# Altium project Systems Level Tester.PrjPcb
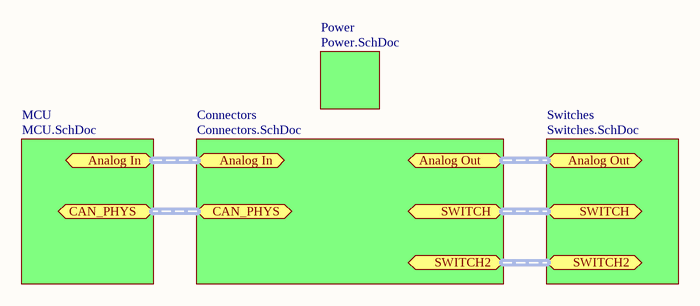
[diagram p0: Main.SchDoc]
5 sheets, 38 parts. Net scope: flat (ports and power ports of the same name join across sheets).
Board file: Systems Level Tester.PcbDoc
Sheets:
  Main.SchDoc
    Switches = Switches.SchDoc
    MCU = MCU.SchDoc
    Connectors = Connectors.SchDoc
    Power = Power.SchDoc

## Sheet Main.SchDoc
size Letter

### Sub-sheets
Connectors = Connectors.SchDoc: no entries
MCU = MCU.SchDoc: no entries
Power = Power.SchDoc: no entries
Switches = Switches.SchDoc: no entries

### Ports
Analog In (harness Analog_In), Analog Out (harness Analog_Out), CAN_PHYS (harness CAN_PHYS), SWITCH2 (harness SWITCH2), SWITCH (harness SWITCH)

## Sheet Switches.SchDoc
size Letter
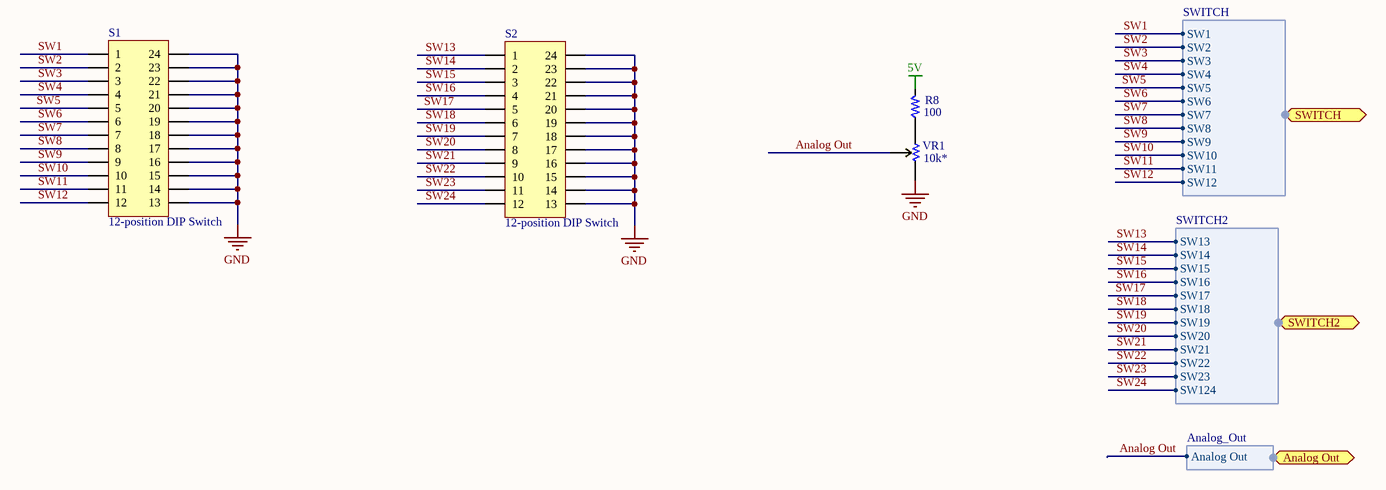
[diagram p1: Switches.SchDoc]

### Parts
R8  Resistance: 100  [PCB_GENERIC_SMD_0603]  (hidden comment: SCH_GENERIC_RESISTOR_0603)
S1  12-position DIP Switch  [12-Position DIP Switch]
S2  12-position DIP Switch  [12-Position DIP Switch]
VR1  10k*  [Rotary Pot]

### Ports
Analog Out (harness Analog_Out), SWITCH2 (harness SWITCH2), SWITCH (harness SWITCH)

### Harnesses
SWITCH: SW1, SW2, SW3, SW4, SW5, SW6, SW7, SW8, SW9, SW10, SW11, SW12
Analog_Out: Analog Out
SWITCH2: SW13, SW14, SW15, SW16, SW17, SW18, SW19, SW20, SW21, SW22, SW23, SW124

### Nets
5V: R8.2
GND: S1.13 S1.14 S1.15 S1.16 S1.17 S1.18 S1.19 S1.20 S1.21 S1.22 S1.23 S1.24 S2.13 S2.14 S2.15 S2.16 S2.17 S2.18 S2.19 S2.20 S2.21 S2.22 S2.23 S2.24 VR1.3
Analog Out: VR1.2 ; port Analog Out.Analog Out
SW1: S1.1 ; port SWITCH.SW1
SW2: S1.2 ; port SWITCH.SW2
SW3: S1.3 ; port SWITCH.SW3
SW4: S1.4 ; port SWITCH.SW4
SW5: S1.5 ; port SWITCH.SW5
SW6: S1.6 ; port SWITCH.SW6
SW7: S1.7 ; port SWITCH.SW7
SW8: S1.8 ; port SWITCH.SW8
SW9: S1.9 ; port SWITCH.SW9
SW10: S1.10 ; port SWITCH.SW10
SW11: S1.11 ; port SWITCH.SW11
SW12: S1.12 ; port SWITCH.SW12
SW13: S2.1 ; port SWITCH2.SW13
SW14: S2.2 ; port SWITCH2.SW14
SW15: S2.3 ; port SWITCH2.SW15
SW16: S2.4 ; port SWITCH2.SW16
SW17: S2.5 ; port SWITCH2.SW17
SW18: S2.6 ; port SWITCH2.SW18
SW19: S2.7 ; port SWITCH2.SW19
SW20: S2.8 ; port SWITCH2.SW20
SW21: S2.9 ; port SWITCH2.SW21
SW22: S2.10 ; port SWITCH2.SW22
SW23: S2.11 ; port SWITCH2.SW23
SW24: S2.12 ; port SWITCH2.SW124
NetR8_1: R8.1 VR1.1

### Library data of the parts
R8 = SCH_GENERIC_RESISTOR_0603: Generic SMD resistor 0603
S1 S2 = 12-position DIP Switch: Manufacturer: CTS Electronics; Manufacturer No.: 209-12LPST
VR1 = Rotary Pot: Manufacturer: CTS Electronics; Manufacturer ID: 296UD103B1N; Max Resistance: 10k; Tolerance: 20%

## Sheet MCU.SchDoc
size Letter
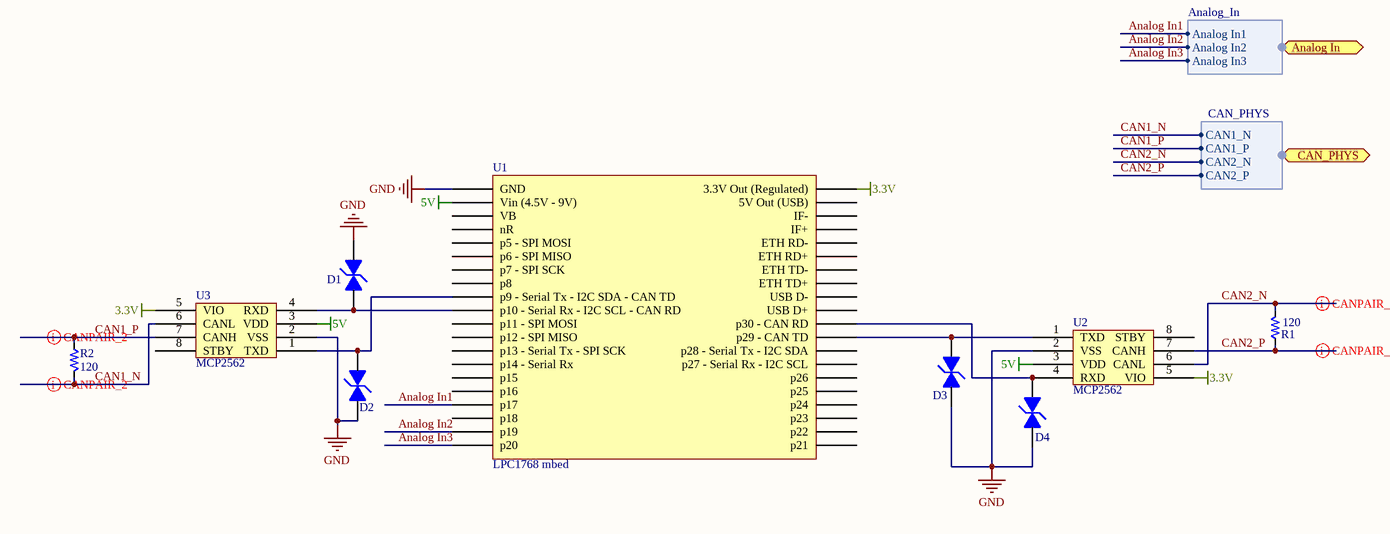
[diagram p2: MCU.SchDoc]

### Parts
D1  TVS Diode  [TVS Diode]  (value not drawn)
D2  TVS Diode  [TVS Diode]  (value not drawn)
D3  TVS Diode  [TVS Diode]  (value not drawn)
D4  TVS Diode  [TVS Diode]  (value not drawn)
R1  120  [PCB_GENERIC_SMD_0603]
R2  120  [PCB_GENERIC_SMD_0603]
U1  LPC1768 mbed  [LPC 1768 mbed Layout]
U2  MCP2562  [MCP2562]
U3  MCP2562  [MCP2562]

### Ports
Analog In (harness Analog_In), CAN_PHYS (harness CAN_PHYS)

### Harnesses
Analog_In: Analog In1, Analog In2, Analog In3
CAN_PHYS: CAN1_N, CAN1_P, CAN2_N, CAN2_P

### Nets
3.3V: U1.40(3.3V_Out_(Regulated)) U2.5(VIO) U3.5(VIO)
5V: U1.2(Vin_(4.5V_-_9V)) U2.3(VDD) U3.3(VDD)
GND: D1.2 D2.2 D3.1 D4.1 U1.1(GND) U2.2(VSS) U3.2(VSS)
Analog In1: U1.17(p17) ; port Analog In.Analog In1
Analog In2: U1.19(p19) ; port Analog In.Analog In2
Analog In3: U1.20(p20) ; port Analog In.Analog In3
CAN1_N: R2.2 U3.6(CANL) ; port CAN_PHYS.CAN1_N
CAN1_P: R2.1 U3.7(CANH) ; port CAN_PHYS.CAN1_P
CAN2_N: R1.2 U2.6(CANL) ; port CAN_PHYS.CAN2_N
CAN2_P: R1.1 U2.7(CANH) ; port CAN_PHYS.CAN2_P
NetD1_1: D1.1 U1.10(p10_-_Serial_Rx_-_I2C_SCL_-_CAN_RD) U3.4(RXD)
NetD2_1: D2.1 U1.9(p9_-_Serial_Tx_-_I2C_SDA_-_CAN_TD) U3.1(TXD)
NetD3_2: D3.2 U1.29(p29_-_CAN_TD) U2.1(TXD)
NetD4_2: D4.2 U1.30(p30_-_CAN_RD) U2.4(RXD)

Not connected (* = marked no-connect by the designer): U1 3(VB) 4(nR) 5(p5_-_SPI_MOSI) 6(p6_-_SPI_MISO) 7(p7_-_SPI_SCK) 8(p8) 11(p11_-_SPI_MOSI) 12(p12_-_SPI_MISO) 13(p13_-_Serial_Tx_-_SPI_SCK) 14(p14_-_Serial_Rx) 15(p15) 16(p16) 18(p18) 21(p21) 22(p22) 23(p23) 24(p24) 25(p25) 26(p26) 27(p27_-_Serial_Rx_-_I2C_SCL) 28(p28_-_Serial_Tx_-_I2C_SDA) 31(USB_D+) 32(USB_D-) 33(ETH_TD+) 34(ETH_TD-) 35(ETH_RD+) 36(ETH_RD-) 37(IF+) 38(IF-) 39(5V_Out_(USB)); U2 8(STBY); U3 8(STBY)

### Layout directives
differential pair: CAN1_N, CAN1_P, CAN2_N, CAN2_P

### Library data of the parts
D1-D4 = TVS Diode: Manufacturer: Bourns; Manufacturer ID: CDSOD323-T03SC
R1 R2 = SCH_GENERIC_RESISTOR_0603: 120 Ohms; Resistance: 120

## Sheet Connectors.SchDoc
size Letter
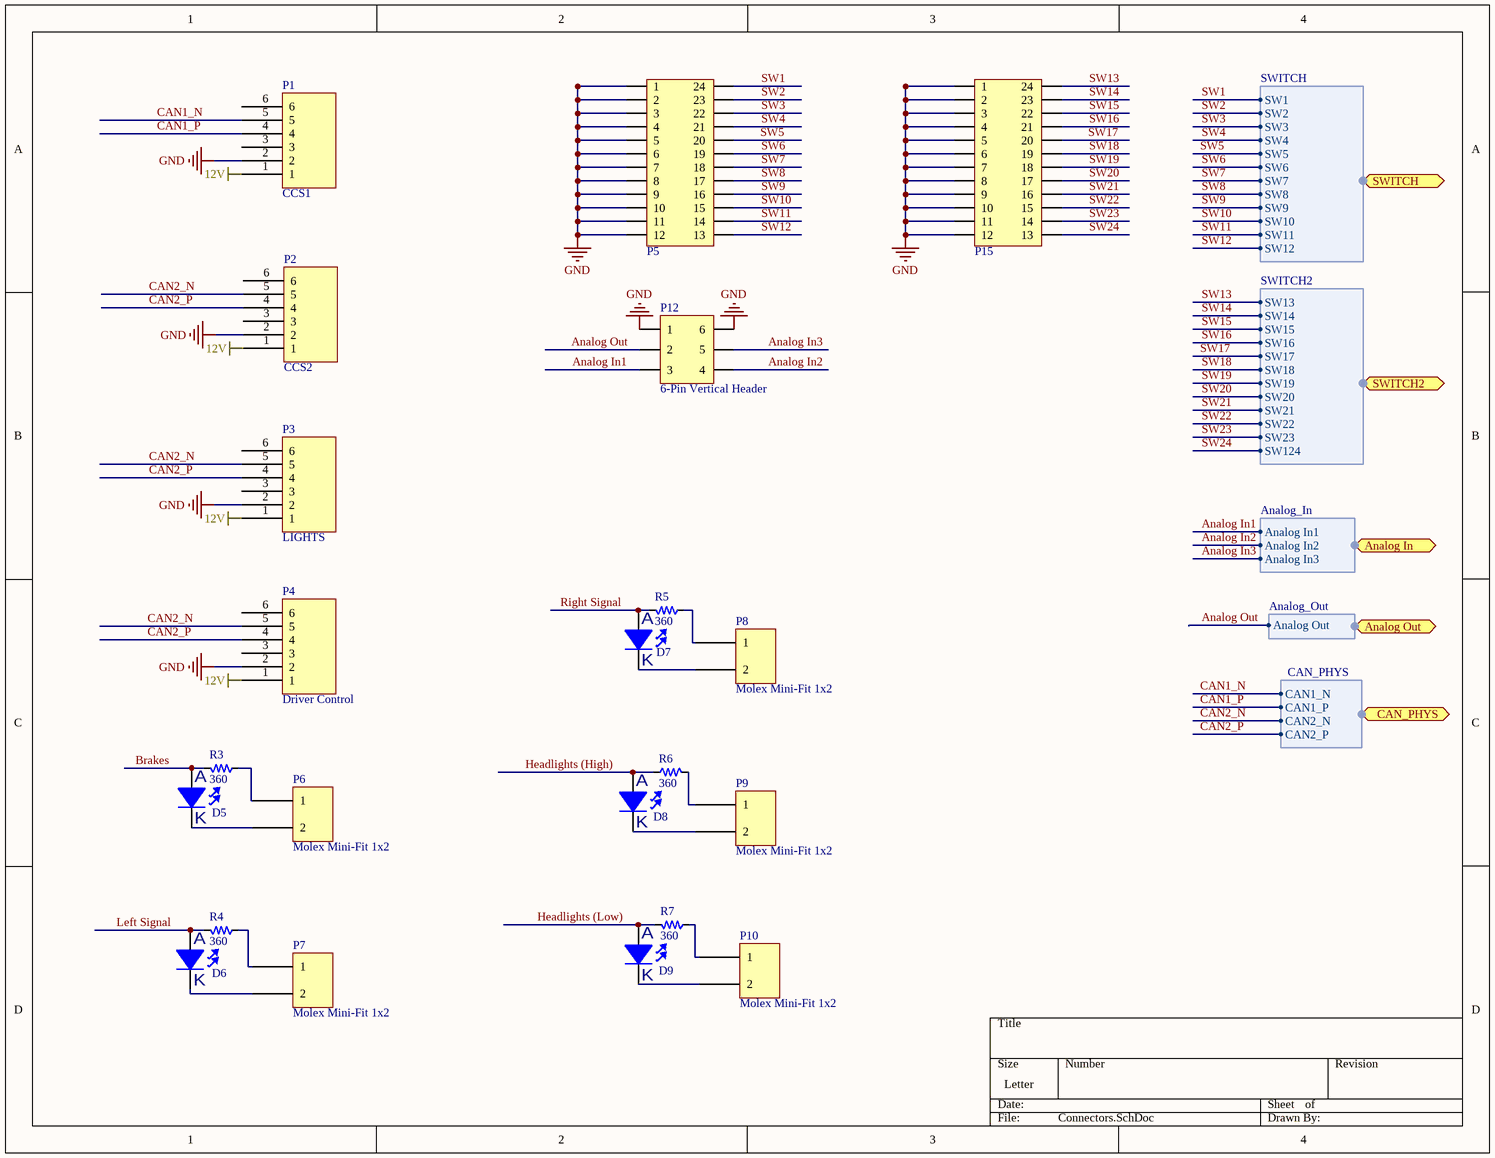
[diagram p3: Connectors.SchDoc]

### Parts
D5  LED RED  [RED LED]  (value not drawn)
D6  LED RED  [RED LED]  (value not drawn)
D7  LED RED  [RED LED]  (value not drawn)
D8  LED RED  [RED LED]  (value not drawn)
D9  LED RED  [RED LED]  (value not drawn)
P1  CCS1  [PCB_MLX_MICROFIT_3X2]
P2  CCS2  [PCB_MLX_MICROFIT_3X2]
P3  LIGHTS  [PCB_MLX_MICROFIT_3X2]
P4  Driver Control  [PCB_MLX_MICROFIT_3X2]
P5  24-Pin Vertical Header  [24-Pin Vertical Header]  (value not drawn)
P6  Molex Mini-Fit 1x2  [Molex Mini-Fit Jr 2x1]
P7  Molex Mini-Fit 1x2  [Molex Mini-Fit Jr 2x1]
P8  Molex Mini-Fit 1x2  [Molex Mini-Fit Jr 2x1]
P9  Molex Mini-Fit 1x2  [Molex Mini-Fit Jr 2x1]
P10  Molex Mini-Fit 1x2  [Molex Mini-Fit Jr 2x1]
P12  6-Pin Vertical Header  [6-Pin Vertical Header]
P15  24-Pin Vertical Header  [24-Pin Vertical Header]  (value not drawn)
R3  Resistance: 360  [PCB_GENERIC_SMD_0603]  (hidden comment: SCH_GENERIC_RESISTOR_0603)
R4  Resistance: 360  [PCB_GENERIC_SMD_0603]  (hidden comment: SCH_GENERIC_RESISTOR_0603)
R5  Resistance: 360  [PCB_GENERIC_SMD_0603]  (hidden comment: SCH_GENERIC_RESISTOR_0603)
R6  Resistance: 360  [PCB_GENERIC_SMD_0603]  (hidden comment: SCH_GENERIC_RESISTOR_0603)
R7  Resistance: 360  [PCB_GENERIC_SMD_0603]  (hidden comment: SCH_GENERIC_RESISTOR_0603)

### Ports
Analog In (harness Analog_In), Analog Out (harness Analog_Out), CAN_PHYS (harness CAN_PHYS), SWITCH2 (harness SWITCH2), SWITCH (harness SWITCH)

### Harnesses
SWITCH: SW1, SW2, SW3, SW4, SW5, SW6, SW7, SW8, SW9, SW10, SW11, SW12
Analog_In: Analog In1, Analog In2, Analog In3
Analog_Out: Analog Out
CAN_PHYS: CAN1_N, CAN1_P, CAN2_N, CAN2_P
SWITCH2: SW13, SW14, SW15, SW16, SW17, SW18, SW19, SW20, SW21, SW22, SW23, SW124

### Nets
12V: P1.1 P2.1 P3.1 P4.1
GND: P1.2 P2.2 P3.2 P4.2 P5.1 P5.2 P5.3 P5.4 P5.5 P5.6 P5.7 P5.8 P5.9 P5.10 P5.11 P5.12 P12.1 P12.6 P15.1 P15.2 P15.3 P15.4 P15.5 P15.6 P15.7 P15.8 P15.9 P15.10 P15.11 P15.12
Analog In1: P12.3 ; port Analog In.Analog In1
Analog In2: P12.4 ; port Analog In.Analog In2
Analog In3: P12.5 ; port Analog In.Analog In3
Analog Out: P12.2 ; port Analog Out.Analog Out
Brakes: D5.2 R3.2
CAN1_N: P1.5 ; port CAN_PHYS.CAN1_N
CAN1_P: P1.4 ; port CAN_PHYS.CAN1_P
CAN2_N: P2.5 P3.5 P4.5 ; port CAN_PHYS.CAN2_N
CAN2_P: P2.4 P3.4 P4.4 ; port CAN_PHYS.CAN2_P
Headlights (High): D8.2 R6.1
Headlights (Low): D9.2 R7.2
Left Signal: D6.2 R4.2
Right Signal: D7.2 R5.2
SW1: P5.24 ; port SWITCH.SW1
SW2: P5.23 ; port SWITCH.SW2
SW3: P5.22 ; port SWITCH.SW3
SW4: P5.21 ; port SWITCH.SW4
SW5: P5.20 ; port SWITCH.SW5
SW6: P5.19 ; port SWITCH.SW6
SW7: P5.18 ; port SWITCH.SW7
SW8: P5.17 ; port SWITCH.SW8
SW9: P5.16 ; port SWITCH.SW9
SW10: P5.15 ; port SWITCH.SW10
SW11: P5.14 ; port SWITCH.SW11
SW12: P5.13 ; port SWITCH.SW12
SW13: P15.24 ; port SWITCH2.SW13
SW14: P15.23 ; port SWITCH2.SW14
SW15: P15.22 ; port SWITCH2.SW15
SW16: P15.21 ; port SWITCH2.SW16
SW17: P15.20 ; port SWITCH2.SW17
SW18: P15.19 ; port SWITCH2.SW18
SW19: P15.18 ; port SWITCH2.SW19
SW20: P15.17 ; port SWITCH2.SW20
SW21: P15.16 ; port SWITCH2.SW21
SW22: P15.15 ; port SWITCH2.SW22
SW23: P15.14 ; port SWITCH2.SW23
SW24: P15.13 ; port SWITCH2.SW124
NetD5_1: D5.1 P6.2
NetD6_1: D6.1 P7.2
NetD7_1: D7.1 P8.2
NetD8_1: D8.1 P9.2
NetD9_1: D9.1 P10.2
NetP6_1: P6.1 R3.1
NetP7_1: P7.1 R4.1
NetP8_1: P8.1 R5.1
NetP9_1: P9.1 R6.2
NetP10_1: P10.1 R7.1

Not connected (* = marked no-connect by the designer): P1 3 6; P2 3 6; P3 3 6; P4 3 6

### Notes on the sheet
- (in symbol LED RED) A; K

### Library data of the parts
P1-P4 = SCH_MLX_MICROFIT_3X2
P5 P15 = 24-Pin Vertical Header: Manufacturer: Sullins; Manufacturer No.: PPPC132LFBN-RC
P12 = 6-Pin Vertical Header: Manufacturer: Sullins; Manufacturer ID: PPPC032LFBN-RC
R3-R7 = SCH_GENERIC_RESISTOR_0603: Generic SMD resistor 0603

## Sheet Power.SchDoc
size Letter
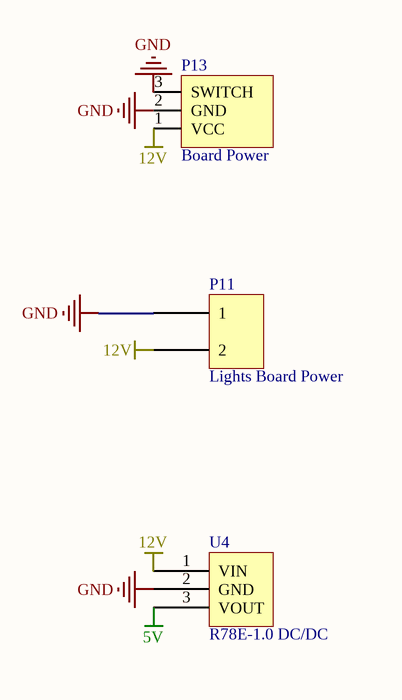
[diagram p4: Power.SchDoc]

### Parts
P11  Lights Board Power  [Molex Mini-Fit Jr 2x1]
P13  Board Power  [BARREL JACK PJ007]
U4  R78E-1.0 DC/DC  [R78-1.0]

### Nets
5V: U4.3(VOUT)
12V: P11.2 P13.1(VCC) U4.1(VIN)
GND: P11.1 P13.2(GND) P13.3(SWITCH) U4.2(GND)

### Library data of the parts
P11 = Molex Mini-Fit 1x2
P13 = Component_1
U4 = R78E-1.0

## Nets that join several sheets
5V: Switches (R8.2), MCU (U1.2 U2.3 U3.3), Power (U4.3)
12V: Connectors (P1.1 P2.1 P3.1 P4.1), Power (P11.2 P13.1 U4.1)
GND: Switches (25 pins), MCU (7 pins), Connectors (30 pins), Power (P11.1 P13.2 P13.3 U4.2)
Analog In1: MCU (U1.17), Connectors (P12.3)
Analog In2: MCU (U1.19), Connectors (P12.4)
Analog In3: MCU (U1.20), Connectors (P12.5)
Analog Out: Switches (VR1.2), Connectors (P12.2)
CAN1_N: MCU (R2.2 U3.6), Connectors (P1.5)
CAN1_P: MCU (R2.1 U3.7), Connectors (P1.4)
CAN2_N: MCU (R1.2 U2.6), Connectors (P2.5 P3.5 P4.5)
CAN2_P: MCU (R1.1 U2.7), Connectors (P2.4 P3.4 P4.4)
SW1: Switches (S1.1), Connectors (P5.24)
SW2: Switches (S1.2), Connectors (P5.23)
SW3: Switches (S1.3), Connectors (P5.22)
SW4: Switches (S1.4), Connectors (P5.21)
SW5: Switches (S1.5), Connectors (P5.20)
SW6: Switches (S1.6), Connectors (P5.19)
SW7: Switches (S1.7), Connectors (P5.18)
SW8: Switches (S1.8), Connectors (P5.17)
SW9: Switches (S1.9), Connectors (P5.16)
SW10: Switches (S1.10), Connectors (P5.15)
SW11: Switches (S1.11), Connectors (P5.14)
SW12: Switches (S1.12), Connectors (P5.13)
SW13: Switches (S2.1), Connectors (P15.24)
SW14: Switches (S2.2), Connectors (P15.23)
SW15: Switches (S2.3), Connectors (P15.22)
SW16: Switches (S2.4), Connectors (P15.21)
SW17: Switches (S2.5), Connectors (P15.20)
SW18: Switches (S2.6), Connectors (P15.19)
SW19: Switches (S2.7), Connectors (P15.18)
SW20: Switches (S2.8), Connectors (P15.17)
SW21: Switches (S2.9), Connectors (P15.16)
SW22: Switches (S2.10), Connectors (P15.15)
SW23: Switches (S2.11), Connectors (P15.14)
SW24: Switches (S2.12), Connectors (P15.13)